# Altium schematic sheet Ethernet.SchDoc: Hrafn
size Tabloid; DrawnBy: Nicholas Belsten; Organization: MIT; Address1: Route 40; Address2: Westford MA 01886; Address3: USA; DocumentNumber: 7; SheetNumber: 9; SheetTotal: 10; DCN: Aika; ProgramName: AERO-VISTA; Section: Ethernet
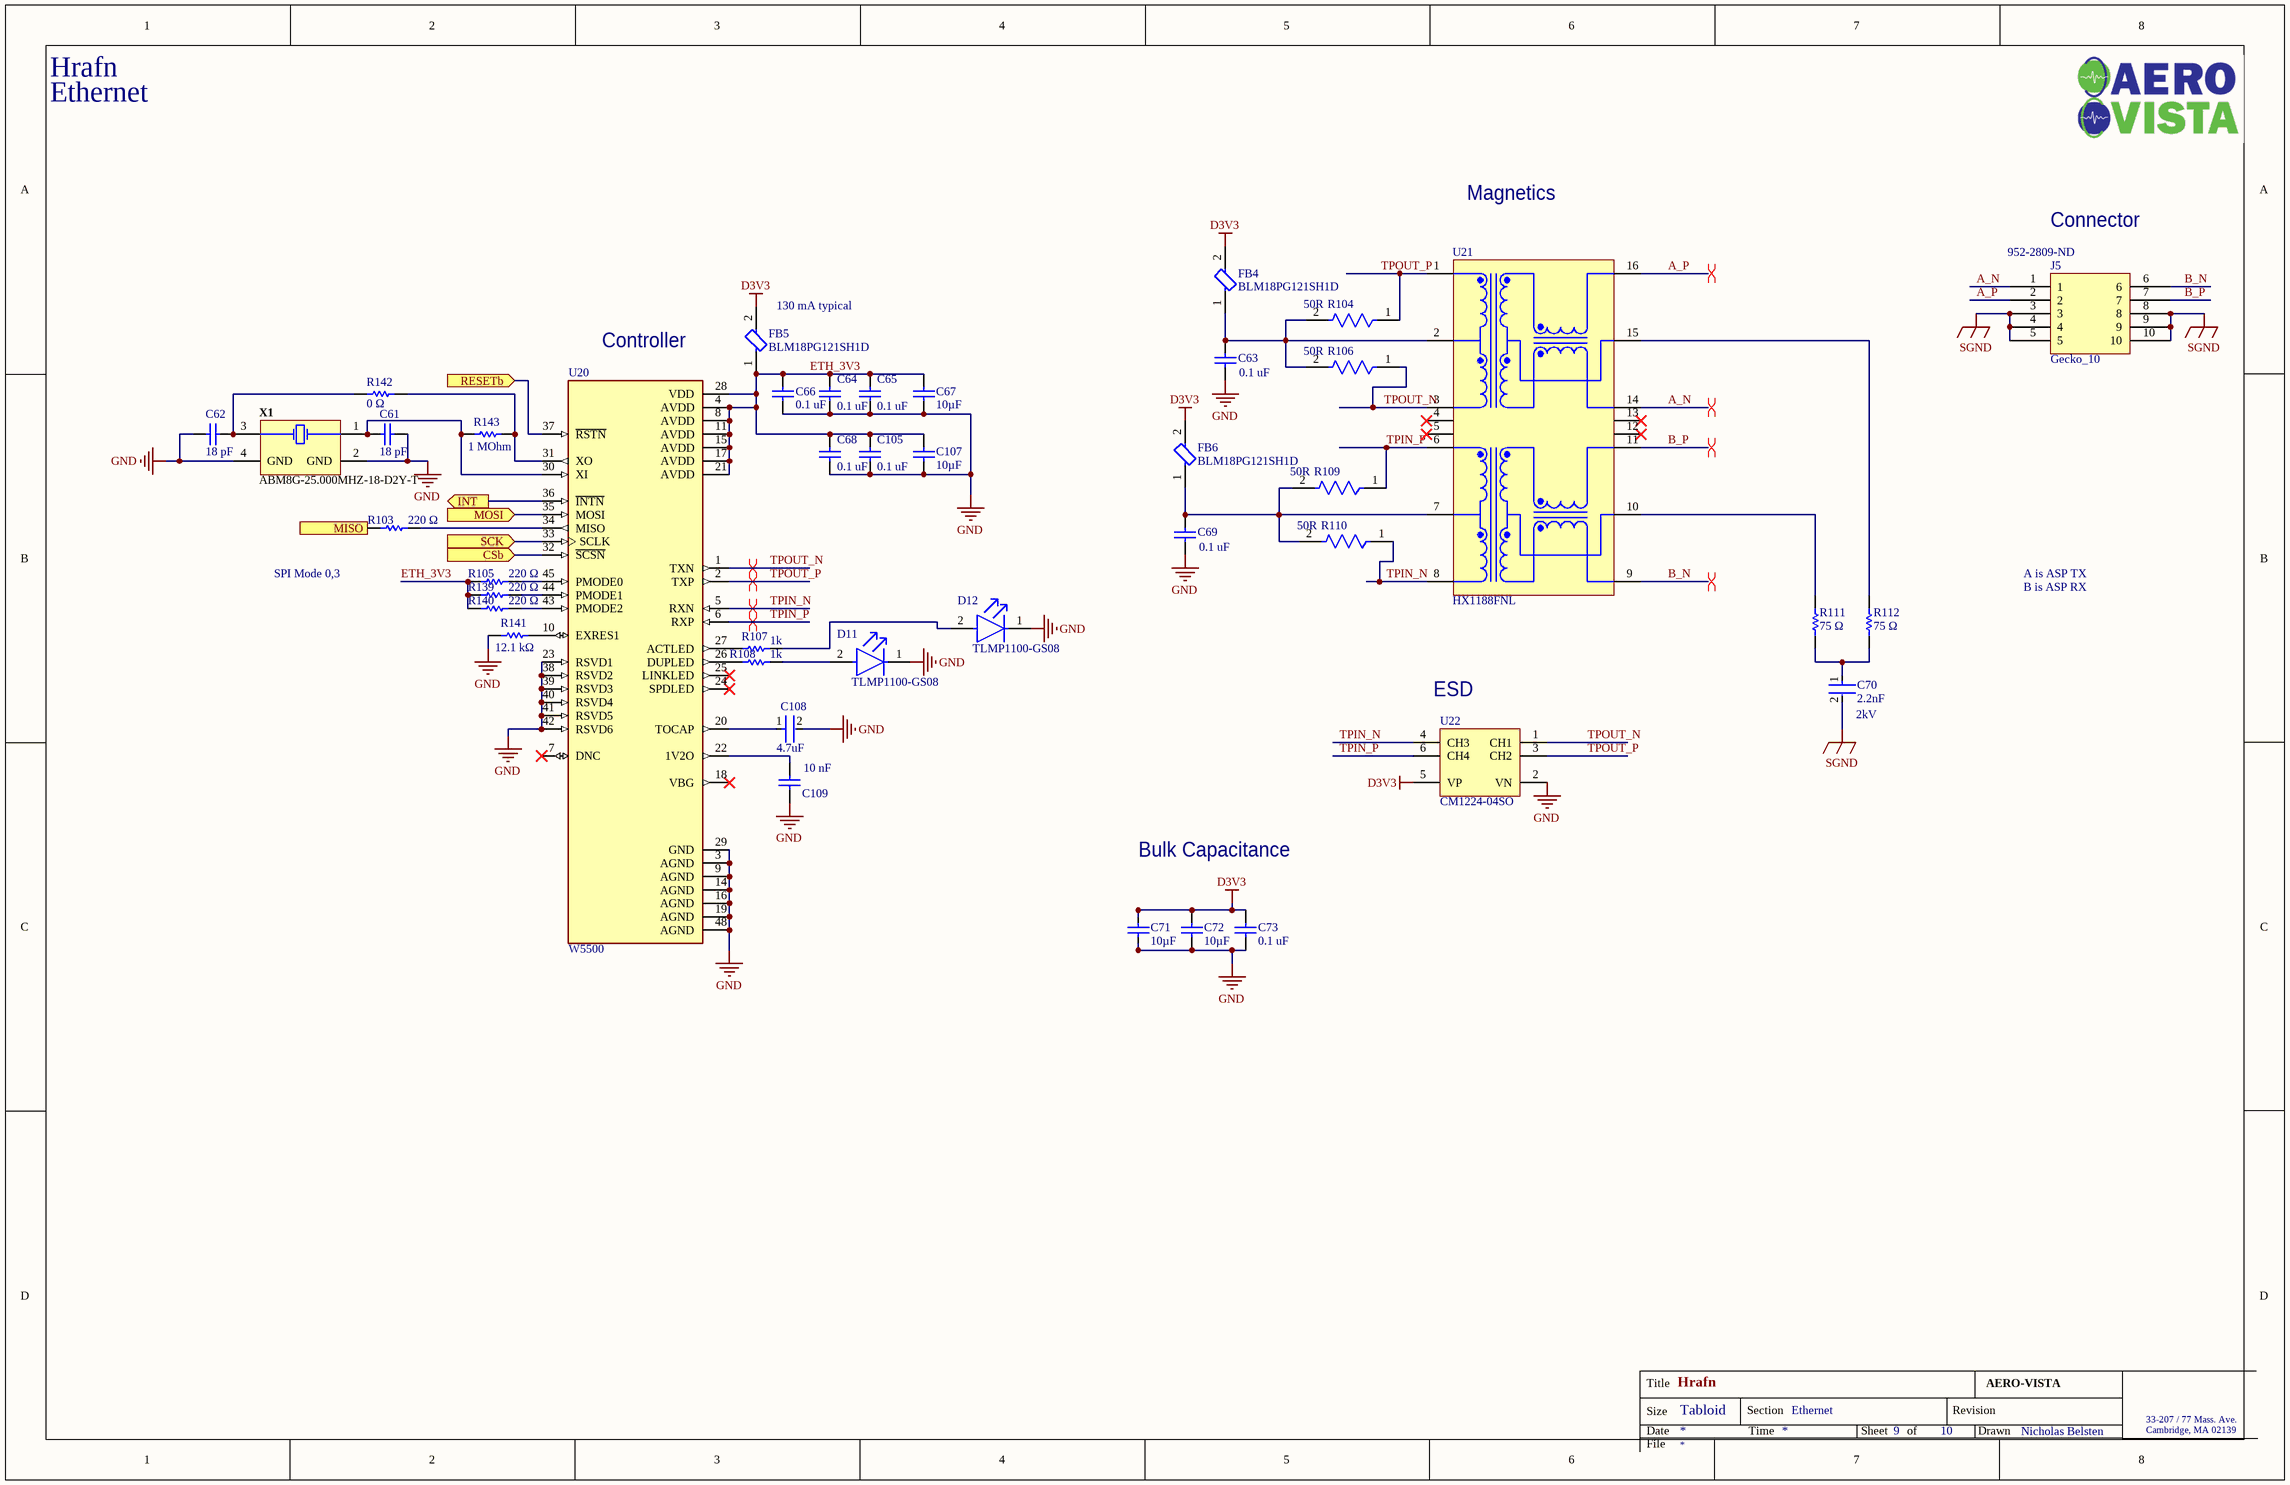
[diagram p0: Ethernet.SchDoc]

## Parts
C61  Capacitance: 18 pF  [CAPC1005X55X25LL05T10]  (hidden comment: GRM1555C1H180JA01D)
C62  Capacitance: 18 pF  [CAPC1005X55X25LL05T10]  (hidden comment: GRM1555C1H180JA01D)
C63  0.1 uF  [CAPC0402(1005)60_L]
C64  0.1 uF  [CAPC0402(1005)60_L]
C65  0.1 uF  [CAPC0402(1005)60_L]
C66  0.1 uF  [CAPC0402(1005)60_L]
C67  Capacitance: 10µF  [CAPC1608X100X35LL20T25]  (hidden comment: EMK107BBJ106MA-T)
C68  0.1 uF  [CAPC0402(1005)60_L]
C69  0.1 uF  [CAPC0402(1005)60_L]
C70  2.2nF  Voltage Rating (DC): 2kV  [FP-CGA6P-MFG]
C71  Capacitance: 10µF  [CAPC1608X100X35LL20T25]  (hidden comment: EMK107BBJ106MA-T)
C72  Capacitance: 10µF  [CAPC1608X100X35LL20T25]  (hidden comment: EMK107BBJ106MA-T)
C73  0.1 uF  [CAPC0402(1005)60_L]
C105  0.1 uF  [CAPC0402(1005)60_L]
C107  Capacitance: 10µF  [CAPC1608X100X35LL20T25]  (hidden comment: EMK107BBJ106MA-T)
C108  Capacitance: 4.7uF  [FP-GRM188-0_2-IPC_C]  (hidden comment: GRM188R6YA475KE15D)
C109  Capacitance: 10 nF  [CAPC1005X55X25LL05T10]  (hidden comment: GRM155R71E103KA01D)
D11  TLMP1100-GS08  [FP-6_541-5056_01-4-MFG]
D12  TLMP1100-GS08  [FP-6_541-5056_01-4-MFG]
FB4  BLM18PG121SH1D  [FP-BLM18-0_15-t0_8-IPC_C]
FB5  BLM18PG121SH1D  [FP-BLM18-0_15-t0_8-IPC_C]
FB6  BLM18PG121SH1D  [FP-BLM18-0_15-t0_8-IPC_C]
J5  Gecko_10  Supplier Part Number 1: 952-2809-ND  [GECK10-dup]
R103  220 Ω  [RESC1005X40X25LL05T05]
R104  Resistance: 50R  [FP-CRCW0603-e3-MFG]  (hidden comment: CRCW060350R0FKEA)
R105  220 Ω  [RESC1005X40X25LL05T05]
R106  Resistance: 50R  [FP-CRCW0603-e3-MFG]  (hidden comment: CRCW060350R0FKEA)
R107  Resistance: 1k  [RESC1005X40X25LL05T05]  (hidden comment: ERJ-2GEJ102X)
R108  Resistance: 1k  [RESC1005X40X25LL05T05]  (hidden comment: ERJ-2GEJ102X)
R109  Resistance: 50R  [FP-CRCW0603-e3-MFG]  (hidden comment: CRCW060350R0FKEA)
R110  Resistance: 50R  [FP-CRCW0603-e3-MFG]  (hidden comment: CRCW060350R0FKEA)
R111  75 Ω  [RESC1005X40X25NL05T05]
R112  75 Ω  [RESC1005X40X25NL05T05]
R139  220 Ω  [RESC1005X40X25LL05T05]
R140  220 Ω  [RESC1005X40X25LL05T05]
R141  Resistance: 12.1 kΩ  [RESC1005X40X25LL05T05]  (hidden comment: ERJ-2RKF1212X)
R142  Resistance: 0 Ω  [RESC1005X40X25LL05T05]  (hidden comment: ERJ2GE0R00X)
R143  Resistance: 1 MOhm  [RESC1005X37X25LL05T10]  (hidden comment: AC0402FR-071ML)
U20  W5500  [TSQFP50P900X900X160-48L]
U21  HX1188FNL  [PULS-HX1188FNL-SMT-16_V]
U22  CM1224-04SO  [ONSC-SOT23-6-527AJ_V]
X1  ABM8G-25.000MHZ-18-D2Y-T  [ABRA-ABM8G_V]

## Ports
CSb (in), INT (out), MISO (out), MOSI (in), RESETb (in), SCK (in)

## Nets
D3V3: C71.2 C72.2 C73.2 FB4.2 FB5.2 FB6.2 U22.5(VP)
GND: C61.1 C62.2 C63.1 C64.1 C65.1 C66.2 C67.2 C68.1 C69.1 C71.1 C72.1 C73.1 C105.1 C107.2 C108.2 C109.1 D11.1(C) D12.1(C) R141.1 U20.3(AGND) U20.9(AGND) U20.14(AGND) U20.16(AGND) U20.19(AGND) U20.23(RSVD1) U20.29(GND) U20.38(RSVD2) U20.39(RSVD3) U20.40(RSVD4) U20.41(RSVD5) U20.42(RSVD6) U20.48(AGND) U22.2(VN) X1.2(GND) X1.4(GND)
SGND: C70.2 J5.3 J5.4 J5.5 J5.8 J5.9 J5.10
A_N: J5.1 U21.14(TX-)
A_P: J5.2 U21.16(TX+)
B_N: J5.6 U21.9(RX-)
B_P: J5.7 U21.11(RX+)
CSb: U20.32(~{SCSN}) ; port CSb
ETH_3V3: C64.2 C65.2 C66.1 C67.1 C68.2 C105.2 C107.1 FB5.1 R105.1 R139.1 R140.1 U20.4(AVDD) U20.8(AVDD) U20.11(AVDD) U20.15(AVDD) U20.17(AVDD) U20.21(AVDD) U20.28(VDD)
INT: U20.36(~{INTN}) ; port INT
MISO: R103.1 ; port MISO
MOSI: U20.35(MOSI) ; port MOSI
RESETb: U20.37(~{RSTN}) ; port RESETb
SCK: U20.33(SCLK) ; port SCK
TPIN_N: R110.1 U20.5(RXN) U21.8(RD-) U22.4(CH3)
TPIN_P: R109.1 U20.6(RXP) U21.6(RD+) U22.6(CH4)
TPOUT_N: R106.1 U20.1(TXN) U21.3(TD-) U22.1(CH1)
TPOUT_P: R104.1 U20.2(TXP) U21.1(TD+) U22.3(CH2)
NetC61_2: C61.2 R143.1 U20.30(XI) X1.1(X1)
NetC62_1: C62.1 R142.2 X1.3(X2)
NetC63_2: C63.2 FB4.1 R104.2 R106.2 U21.2(TCT)
NetC69_2: C69.2 FB6.1 R109.2 R110.2 U21.7(RCT)
NetC70_1: C70.1 R111.1 R112.1
NetC108_1: C108.1 U20.20(TOCAP)
NetC109_2: C109.2 U20.22(1V2O)
NetD11_2: D11.2(A) R108.2
NetD12_2: D12.2(A) R107.2
NetR103_2: R103.2 U20.34(MISO)
NetR105_2: R105.2 U20.45(PMODE0)
NetR107_1: R107.1 U20.27(ACTLED)
NetR108_1: R108.1 U20.26(DUPLED)
NetR111_2: R111.2 U21.10(CMT)
NetR112_2: R112.2 U21.15(CMT)
NetR139_2: R139.2 U20.44(PMODE1)
NetR140_2: R140.2 U20.43(PMODE2)
NetR141_2: R141.2 U20.10(EXRES1)
NetR142_1: R142.1 R143.2 U20.31(XO)

Not connected (* = marked no-connect by the designer): U20 7(DNC)* 18(VBG)* 24(SPDLED)* 25(LINKLED)*; U21 4(NC)* 5(NC)* 12(NC)* 13(NC)*

## Layout directives
differential pair; differential pair class ETH: A_N, A_P, B_N, B_P, TPIN_N
differential pair; differential pair class ETH; differential pair class ETH: TPIN_P, TPOUT_N, TPOUT_P

## Notes on the sheet
- Magnetics
- Connector
- Controller
- (near FB5) 130 mA typical
- (near R103) SPI Mode 0,3
- A is ASP TX
- B is ASP RX
- (near U22) ESD
- Bulk Capacitance
- Title
- Size
- Date
- Tabloid
- Section
- Time
- Sheet
- of
- Revision
- Drawn
- 33-207 / 77 Mass. Ave.
- Cambridge, MA 02139
- File

## Library data of the parts
C61 C62 = CMP-2008-03918-1: Manufacturer: Murata; Part Number: GRM1555C1H180JA01D
C63-C66 C68 C69 C73 C105 = CMP-1034-02068-1: CAP 100nF 16V ±5% 0402 (1005 Metric) Thickness 0.6mm SMD; Tolerance: Â±5%; Case-EIA: 0402; Case-Metric: 1005; Technology: SMT; Value: 100nF; Max Thickness: 0.6 mm; Rated Voltage: 16 V
C67 C71 C72 C107 = CMP-2000-06226-1: Chip Capacitor, 10 uF, +/- 20%, 16 V, -55 to 85 degC, 0603 (1608 Metric), RoHS, Tape and Reel; Manufacturer: Taiyo Yuden; Voltage - Rated: 16V; Temperature Coefficient: X5R; Other Names: 587-3238-6; Online Catalog: MSeries; Features: -; Thickness (Max): 0.031"(0.80mm); Package / Case: 0603(1608Metric); Datasheet URL: http://www.yuden.co.jp/ut/product/category/capacitor/EMK107BBJ106MA-T.pdf; Category: Capacitors; Lead Style: -; Family: CeramicCapacitors; Package Description: 2-Pin Surface Mount Device, Body 1.70 x 0.90 mm; Tolerance: ±20%; Manufacturer URL: http://www.t-yuden.com/; Operating Temperature: -55°C~85°C; Lead Spacing: -; Height - Seated (Max): -; Series: M; Applications: GeneralPurpose; Size / Dimension: 0.063"Lx0.031"W(1.60mmx0.80mm); Standard Package: 1; Packaging: Digi-Reel®; Mounting Technology: SurfaceMount; Package Reference: 0603; Ratings: -; Datasheet Version: 10/2016; Mounting Type: SurfaceMount,MLCC
C70 = CMP-08246-001831-1: Cap Ceramic 2.2nF 2000V X7S 20% Pad SMD 1210 +125°C Automotive T/R; Mount: Surface Mount; Case/Package: 1210; Case Code (Imperial): 1210; Package Quantity: 1000; Min Operating Temperature: -55°C; Packaging: Tape and Reel; Max Operating Temperature: 125°C; Height: 2.5mm; Length: 0.126inch; Weight: 0.000564oz; Ratings: AEC-Q200; Thickness: 0.11inch; Width: 0.098inch; Tolerance: 20%; Capacitance: 2.2nF; Dielectric: X7S; Case Code (Metric): 3225; Voltage Rating: 2kV
C108 = CMP-2006-02545-2: Chip Multilayer Ceramic Capacitors for General Purpose, 0603, 4.7uF, X5R, 15%, 10%, 35V; Lead Free: Lead Free; Max Operating Temperature: 85°C; Case Code (Imperial): 0603; Width: 0.8mm; Thickness: 0.031inch; Case Code (Metric): 1608; Min Operating Temperature: -55°C; Voltage Rating (DC): 35V; Dielectric: X5R; Voltage: 35V; Packaging: Tape and Reel; Resistor Type: Ceramic; Weight: 0.000222oz; Mount: Surface Mount; Material: Ceramic; Depth: 0.8mm; Tolerance: 10%; REACH SVHC: No SVHC; Case/Package: 0603; Voltage Rating: 35V; Package Quantity: 4000; Height: 0.8mm; Length: 1.6mm; Termination: SMD/SMT
C109 = CMP-1034-01880-2: Manufacturer: Murata; Part Number: GRM155R71E103KA01D
D11 D12 = CMP-02520-000009-1: LED GREEN 0603 SMD; Manufacturer: Vishay; Max Junction Temp: +120°C; Automotive Grade: Grade 3; Reverse Voltage: 6V; Led Orientation: Top View; Forward Voltage: 2.1V; Luminous Intensity: 15mcd; Forward Current: 20mA; Colour: Pure green; Peak Emmision Wavelength: 562nm; Wavelength: 561nm; Viewing Angle: 160°; Power Dissipation: 90mW; Digikey Description: LED GREEN 0603 SMD; Package: 6.541-5056.01-4; Ambient Temperature Range High: +100°C; Height: 0.65mm; Device Class L1: Optoelectronics; Device Class L2: LEDs; Mouser Description: Standard LEDs - SMD Pure Green; Temperature Range High: +120°C; RoHS: TRUE; Ambient Temperature Range Low: -40°C; Temperature: to +120°C; Manufacturer Part Number: TLMP1100-GS08; ComponentLink2URL: http://www.vishay.com/docs/83173/tlmb1100.pdf; Lead Free: Yes; Octopart: https://octopart.com/tlmp1100-gs08-vishay-55433993; Automotive: Yes; Device Class L3: unset; ComponentLink2Description: Datasheet; Category: Diode
FB4-FB6 = CMP-06046-000335-1: Chip Ferrite Bead, 0603, 120Ω @ 100MHz, 0.05Ω, 25%, 2A; Impedance: 120R; Shielding: Unshielded; Number of Lines: 1; DC Resistance (DCR): 50mR; Case/Package: 0603; Max Current Rating: 2A; Ratings: AEC-Q200; Case Code (Metric): 1608; Height: 0.8mm; Max DC Current: 2A; Contact Plating: Tin; Max Operating Temperature: 125°C; Width: 0.031inch; Number of Circuits: 1; Min Operating Temperature: -55°C; Mount: Surface Mount; Test Frequency: 100MHz; Tolerance: 25%; Packaging: Tape and Reel; Length: 1.6mm; Weight: 7.1E-05oz; Package Quantity: 4000; Case Code (Imperial): 0603; Termination: SMD/SMT; Material: Ferrite; Depth: 0.8mm; Lead Free: Lead Free; Current Rating: 2A
J5 = Gecko_10: Headers & Wire Housings 1.25MM M VERT 3.0MM 2x5 POS; Manufacturer 1: Harwin; Manufacturer Part Number 1: G125-MV11005L1P; Current Rating: 2A; Voltage Rating: 450V; Connector Type: Pin,Male Pin; Number of Positions: 10; Insulation Resistance: 10GR; Pitch: 0.049inch; Supplier 1: Digi-Key; RoHS: Yes; Category: Headers and Wire Housings; Stock 1: 486; Pricing 1: 1=4.73000, 10=4.53800, 100=3.78200, 500=3.21470, 1000=2.74195, 5000=2.45830 (USD); Mount: Through Hole; Contact Plating: Gold; Contact Material: Bronze; Housing Material: Polyamide; Weight: 0.010864oz; Color: Green; Min Operating Temperature: -65°C; Max Operating Temperature: 150°C; Number of Rows: 2; Termination: Solder; Package Quantity: 1; Packaging: Cut Strip; Fastening Type: Latch; Row Spacing: 0.049inch; Flammability Rating: UL94 V-0; ComponentLink1URL: http://www.mouser.com/ds/2/181/C125XX_G125_Gecko_Connectors-1131202.pdf?src-supplier=Mouser; ComponentLink1Description: http://www.mouser.com/ds/2/181/C125XX_G125_Gecko_Connectors-1131202.pdf?src-supplier=Mouser; ComponentLink2URL: https://cdn.harwin.com/pdfs/G125-MVXXX05LXP.pdf?src-supplier=Digi-Key; ComponentLink2Description: https://cdn.harwin.com/pdfs/G125-MVXXX05LXP.pdf?src-supplier=Digi-Key
R103 R105 R139 R140 = CMP-2002-08356-1: Part Number: CRCW040220K0FKED; Manufacturer: Vishay Dale; Resistance: 220 Ω
R104 = CMP-2000-03436-2: RES Thick Film, 50Ω, 1%, 0.1W, 100ppm/°C, 0603; Voltage Rating (DC): 75V; Power Rating: 100mW; Case/Package: 0603; Packaging: Tape and Reel; Military Standard: Not; REACH SVHC: No SVHC; Width: 0.85mm; Max Operating Temperature: 155°C; Case Code (Metric): 1608; Temperature Coefficient: 100ppm/°C; Lead Free: Lead Free; Height: 0.45mm; Composition: Thick Film; Termination: SMD/SMT; Contact Plating: Tin; Number of Pins: 2; Tolerance: 1%; Depth: 0.85mm; Weight: 7.1E-05oz; Min Operating Temperature: -55°C; Length: 1.55mm; Radiation Hardening: No; Voltage Rating: 75V; Case Code (Imperial): 0603; Package Quantity: 5000; Mount: Surface Mount
R106 R109 R110 = CMP-2000-03436-2: RES Thick Film, 50Ω, 1%, 0.1W, 100ppm/°C, 0603; Power Rating: 100mW; Voltage Rating (DC): 75V; Case/Package: 0603; Case Code (Imperial): 0603; Case Code (Metric): 1608; Composition: Thick Film; Contact Plating: Tin; Depth: 0.85mm; Height: 0.45mm; Lead Free: Lead Free; Length: 1.55mm; Max Operating Temperature: 155°C; Military Standard: Not; Min Operating Temperature: -55°C; Mount: Surface Mount; Number of Pins: 2; Package Quantity: 5000; Packaging: Tape and Reel; Radiation Hardening: No; REACH SVHC: No SVHC; Temperature Coefficient: 100ppm/°C; Termination: SMD/SMT; Tolerance: 1%; Voltage Rating: 75V; Weight: 7.1E-05oz; Width: 0.85mm
R107 R108 = CMP-2002-00432-1: Manufacturer: Panasonic; Part Number: ERJ-2GEJ102X
R111 R112 = CMP-2002-01061-1: Manufacturer: Panasonic; Part Number: ERJ-2RKF75R0X; Resistance: 75 Ω
R141 = CMP-2002-00649-1: Manufacturer: Panasonic; Part Number: ERJ-2RKF1212X
R142 = CMP-2000-07451-1: Chip Resistor, 0 Ohm, 0.1 W, -55 to 155 degC, 0402 (1005 Metric), RoHS, Tape and Reel; Manufacturer: Panasonic; Voltage Rating (DC): 50V; Temperature Coefficient: 600ppm/��C; Max Power Dissipation: 100mW; Tolerance: 5%; Number of Terminations: 2; Mount: SurfaceMount; Height: 0.35mm; Packaging: TapeandReel; Contact Plating: Tin; Manufacturer URL: http://www.panasonic.com/; Composition: ThickFilm; Max Operating Temperature: 155degC; REACH SVHC: NoSVHC; Case/Package: 0402; Package Reference: 402; Depth: 0.5mm; Package Description: 2-Pin Surface Mount Device, Body 1 x 0.5 mm; Datasheet URL: https://industrial.panasonic.com/cdbs/www-data/pdf/RDA0000/AOA0000C301.pdf; RoHSCompliant: True; Case Code (Imperial): 0402; Military Standard: Not; Min Operating Temperature: -55degC; Power Rating: 100mW; Datasheet Version: 03/2015; Length: 1mm; Case Code (Metric): 1005; Termination: SMD/SMT; Mounting Technology: SurfaceMount; Voltage Rating: 50V; Width: 0.02inch; Package Quantity: 1; Lead Free: LeadFree; Radiation Hardening: No
R143 = CMP-2002-01800-1: Manufacturer: Yageo; Part Number: AC0402FR-071ML
U20 = W5500: Socket Contact Silver 17-20 AWG Crimp Power; MF: WIZnet; Price: None; Package: LQFP-48 WIZnet; Value: *; MP: W5500; Availability: Unavailable; SnapEDA_Link: https://www.snapeda.com/parts/W5500/WIZnet/view-part/45250/?ref=snap
U21 = CMP-2000-06431-1: Telecom Transformer 1:1/1:1, -40 to 85 degC, 16-Pin SMT, RoHS, Tube; Manufacturer: Pulse Electronics; Turns Ratio - Primary: Secondary:1:1Transmitter,1:1Receiver; Online Catalog: HX1188; Other Names: 553-2200; Other Related Documents: PackagesFNLvs.NL; Transformer Type: IsolationandDataInterface(Encapsulated); Datasheet Version: Rev. B, 05/2014; Family: PulseTransformers; PartNumber: HX1188FNL; Manufacturer URL: http://www.pulseelectronics.com/; Package Description: 16-Pin Surface Mount Device, Body 12.7 x 9.09 mm, Pitch 1.27 mm; Mounting Type: SurfaceMount; Package Reference: SMT; Mounting Technology: SurfaceMount; Datasheet URL: http://productfinder.pulseeng.com/products/datasheets/HX1188FNL.pdf;jsessionid=D0CB5525A348FF42F5E5BE320CB10324; Height - Seated (Max): 5.99mm; Category: Transformers; Standard Package: 40; Size / Dimension: 12.70mmLx9.00mmW
U22 = CMP-1063-00180-1: 4-Channel Low Capacitance ESD Protection Array, 6-Pin SOT-23, Pb-Free, Tape and Reel; Manufacturer: On Semiconductor; Direction: Unidirectional; C Max (pF): 0.8; PPK Max (W): 0.225; Number of Lines: 4; IR Max (uA): 1; ComponentLink3Description: Package Specification; PackageVersion: Rev. B, 02/2012; PackageDescription: 6-Pin Small Outline Transistor, Body 2.85 x 1.55 mm, Pitch 0.95 mm; ComponentLink1URL: http://www.onsemi.com/; ComponentLink3URL: http://www.onsemi.com/pub_link/Collateral/527AJ.PDF; ComponentLink2URL: http://www.onsemi.com/pub_link/Collateral/CM1224-D.PDF; Packing: Tape and Reel; ComponentLink2Description: Datasheet; Mounting Technology: Surface Mount; DatasheetVersion: Rev. 5; PackageReference: SOT23-6-527AJ; ComponentLink1Description: Manufacturer URL; RoHS: Pb-Free; PartNumber: CM1224-04SO
X1 = CMP-2000-05733-1: Ultra Miniature Ceramic Glass Sealed SMD Crystal, 25 MHz, -40 to 85 degC, 4-Pin SMD, RoHS, Tape and Reel; Manufacturer: ABRACON; Frequency: 25MHz; Case Length: 3.2mm; Case Width: 2.5mm; ESR: 60Ohms; Frequency Stability: 30PPM; Tolerance: 20PPM; Case Height: 1mm; Load Capacitance: 18pF; Package Description: 4-Pin Surface Mount Device, Body 2.5 x 3.2 mm, Pitch 2.2 mm; Manufacturer URL: http://www.abracon.com/; Mounting Technology: SurfaceMount; Datasheet Version: 08/2015; Dimensions: 2.5mmWx3.2mmLx1mmH; Operating Temperature Range: -40Cto+85C; Packaging: Reel; RoHS: Details; Product Category: Crystals; Package Reference: ABM8G; Package / Case: 3.2mmx2.5mm; Brand: ABRACON; Datasheet URL: http://www.abracon.com/Resonators/ABM8G.pdf; Termination Style: SMD/SMT; Type: UltraMiniatureGlassSealedCrystal; Mounting Style: SMD/SMT; Series: ABM8G; Factory Pack Quantity: 1000